# EAGLE design power_board (EAGLE 6.6.0)
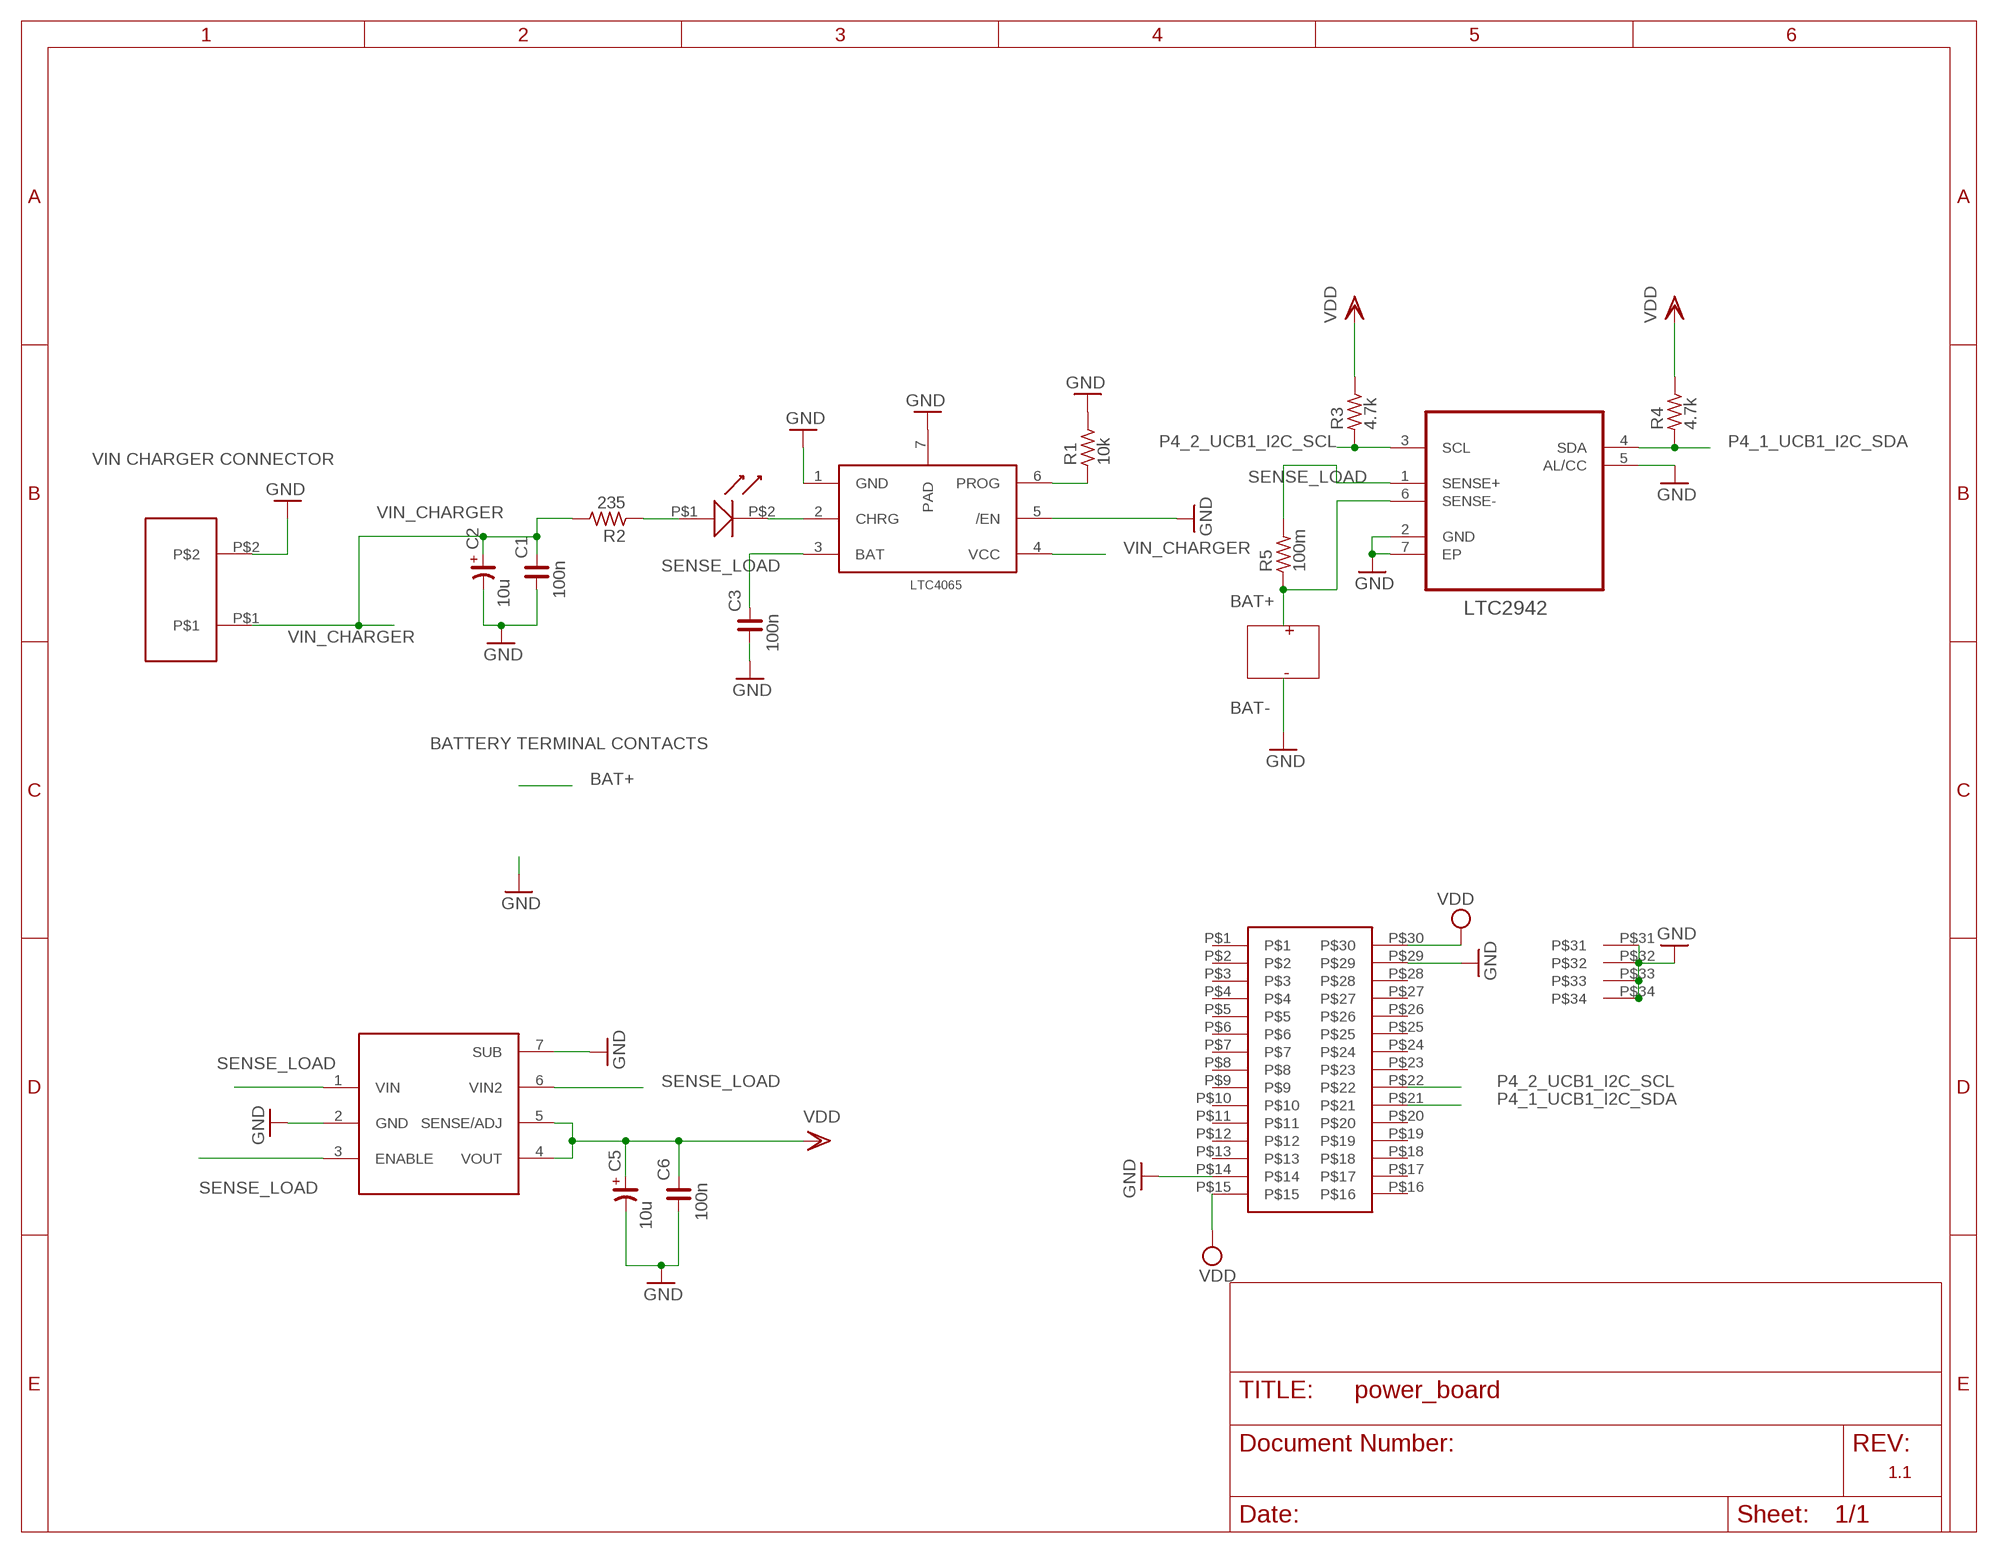
[diagram p0: schematic, sheet 1]

## Parts
C1  100n  C_0402  [C0402]
C2  10u  CP_  [C0402]
C3  100n  C_0402  [C0402]
C5  10u  CP_  [C0402]
C6  100n  C_0402  [C0402]
R1  10k  R_0402  [R0402]
R2  235  R_0402  [R0402]
R3  4.7k  R_0402  [R0402]
R4  4.7k  R_0402  [R0402]
R5  100m  R_0402  [R0402]
U1  LTC2942CDCBTRMPBF  [DFN200X300X80-7N]
U$1  LTC4065  [LTC4065]
U$2  LED0402  [LED_0402]
U$3  55909-0374_PLUG  [55909-0374_PLUG]
U$4  NCP606  [NCP606]
U$5  ASR_2_REC  [ASR_2_CONN]

## Nets
BAT+: R5.1 U1.6(SENSE-)
GND: C1.1 C2.2(-) C3.1 C5.2(-) C6.1 R1.2 U1.2(GND) U1.5(AL/CC) U1.7(EP) U$1.1(GND) U$1.5(/EN) U$1.7(PAD) U$3.P$14 U$3.P$29 U$3.P$31 U$3.P$32 U$3.P$33 U$3.P$34 U$4.2(GND) U$4.7(SUB) U$5.P$2
N$1: R1.1 U$1.6(PROG)
N$2: R2.1 U$2.P$1(A)
N$3: U$1.2(CHRG) U$2.P$2(K)
P4_1_UCB1_I2C_SDA: R4.1 U1.4(SDA) U$3.P$21
P4_2_UCB1_I2C_SCL: R3.1 U1.3(SCL) U$3.P$22
SENSE_LOAD: C3.2 R5.2 U1.1(SENSE+) U$1.3(BAT) U$4.1(VIN) U$4.3(ENABLE) U$4.6(VIN2)
VDD: C5.1(+) C6.2 R3.2 R4.2 U$3.P$15 U$3.P$30 U$4.4(VOUT) U$4.5(SENSE/ADJ)
VIN_CHARGER: C1.2 C2.1(+) R2.2 U$1.4(VCC) U$5.P$1
Unconnected: U$3.P$1 U$3.P$2 U$3.P$3 U$3.P$4 U$3.P$5 U$3.P$6 U$3.P$7 U$3.P$8 U$3.P$9 U$3.P$10 U$3.P$11 U$3.P$12 U$3.P$13 U$3.P$16 U$3.P$17 U$3.P$18 U$3.P$19 U$3.P$20 U$3.P$23 U$3.P$24 U$3.P$25 U$3.P$26 U$3.P$27 U$3.P$28

## Notes on the sheet
- VIN CHARGER CONNECTOR
- +
- -
- BAT-
- BATTERY TERMINAL CONTACTS
- 1.1

## Library data of the parts
C1 C3 C6 = rc-master-smd:C_: NON-POLARIZED CAP
C2 C5 = rc-master-smd:CP_: POLARIZED CAP
R1-R5 = rc-master-smd:R_: RESISTOR
U1 = ltc2942:LTC2942CDCBTRMPBF: Battery Gas Gauge with Temperature, Voltage Measurement; MPN: LTC2942CDCB#TRMPBF; OC_FARNELL: -; OC_NEWARK: 67R9018; PACKAGE: DFN-6; SUPPLIER: Linear Technology
U$1 = ltc4065:LTC4065
U$2 = LED_0402:LED0402
U$3 = Molex_SlimStack:55909-0374_PLUG: 55909-0374_PLUG MOLEX; VENDOR: DK
U$4 = NCP606:NCP606
U$5 = ASR_2_CONN:ASR_2_REC

## Board
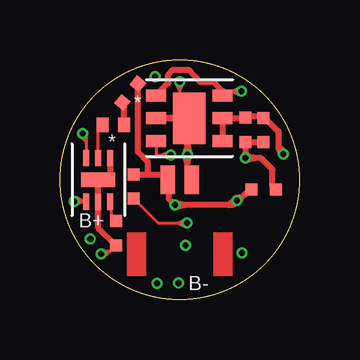
[diagram p1: board, top side]
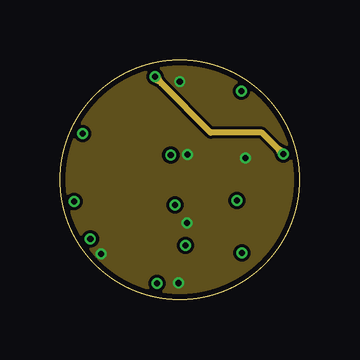
[diagram p2: board, inner layer Route2]
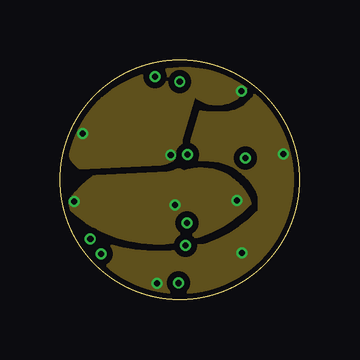
[diagram p3: board, inner layer Route15]
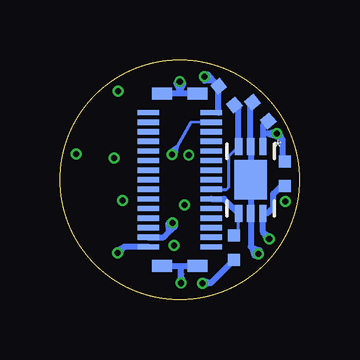
[diagram p4: board, bottom side, seen from below]

Size 10 x 10 mm. Coordinates in mm from the lower left corner, seen from the top.
Outline: circle at 5,5 radius 5
Copper layers (1+2*15+16): Top 0.0356mm / dielectric 0.1702mm / Route2 0.0178mm / dielectric 47mil / Route15 0.0178mm / dielectric 0.1702mm / Bottom 0.0356mm
Design rules "LaenPCBOrder - 4 layers *": minimum track width 5mil, minimum drill 10mil, track to track 5mil, track to pad 5mil, pad to pad 5mil, via to via 5mil, smd to smd 5mil, copper to edge 10mil, drill to drill 5mil, minimum pad ring 4mil, minimum via ring 4mil, stop-mask expansion 3mil, vias tented up to drill 20mil, thermal gap 10mil

### Footprints (pad centres in the part's own frame; a part is rotated, then mirrored left to right if it is on the bottom)
C0402 = smd 0.5 x 0.5: 1 -0.508,0; 2 0.508,0
R0402 = smd 0.5 x 0.5: 1 -0.508,0; 2 0.508,0
DFN200X300X80-7N = smd 0.711 x 0.305: 1 -1.397,0.508; 2 -1.397,0; 3 -1.397,-0.508; 4 1.397,-0.508; 5 1.397,0; 6 1.397,0.508 | smd 1.65 x 1.35: 7 0,0
LTC4065 = smd 0.675 x 0.25: 1 -0.912,0.5; 2 -0.912,0; 3 -0.912,-0.5; 4 0.912,-0.5; 5 0.912,0; 6 0.912,0.5 | smd 0.61 x 1.42: 7 0,0
LED_0402 = smd 0.5 x 0.6: P$1 -0.45,0; P$2 0.45,0
55909-0374_PLUG = smd 0.9 x 0.22: P$1 -1.315,2.8; P$2 -1.315,2.4; P$3 -1.315,2; P$4 -1.315,1.6; P$5 -1.315,1.2; P$6 -1.315,0.8; P$7 -1.315,0.4; P$8 -1.315,0; P$9 -1.315,-0.4; P$10 -1.315,-0.8; P$11 -1.315,-1.2; P$12 -1.315,-1.6; P$13 -1.315,-2; P$14 -1.315,-2.4; P$15 -1.315,-2.8; P$16 1.315,-2.8; P$17 1.315,-2.4; P$18 1.315,-2; P$19 1.315,-1.6; P$20 1.315,-1.2; P$21 1.315,-0.8; P$22 1.315,-0.4; P$23 1.315,0; P$24 1.315,0.4; P$25 1.315,0.8; P$26 1.315,1.2; P$27 1.315,1.6; P$28 1.315,2; P$29 1.315,2.4; P$30 1.315,2.8 | smd 0.85 x 0.5: P$31 -0.74,-3.6; P$32 0.74,-3.6; P$33 -0.74,3.6; P$34 0.74,3.6
NCP606 = smd 0.83 x 0.5: 1 -1.385,0.95; 2 -1.385,0; 3 -1.385,-0.95; 4 1.385,-0.95; 5 1.385,0; 6 1.385,0.95 | smd 1.35 x 2.15: 7 0,0
ASR_2_CONN = smd 0.6 x 1.2: P$1 -0.5,0; P$2 0.5,0

### Placement (x,y rotation side)
C1  3.08,4.72 90 top
C2  8.49,4.58 0 top
C3  1.63,7.84 310 bottom
C5  7.74,7.08 270 top
C6  8.5,7.07 90 top
R1  2.34,2.77 270 top
R2  2.93,8.62 50 top
R3  3.05,8.51 130 bottom
R4  2.73,2.17 270 bottom
R5  0.62,5.25 90 bottom
U1  2.04,4.99 270 bottom
U$1  1.6,5 270 top
U$2  2.22,7.3 180 top
U$3  5,5 0 bottom
U$4  5.4,7.57 0 top
U$5  5,5 0 top

### Tracks (layer width: path | path; a pad name or v marks a point on that pad's centre or on a via)
BAT+  (via drill 0.25)
  Bottom 0.127: R5.1 0.68,4.59
  Bottom 0.22: U1.6 1.36,3.6
  Bottom 0.25: v1.27,2.53 1.48,2.77 1.53,2.81 | 1.53,2.81 U1.6 | 1.53,2.81 1.22,2.62 v1.27,2.53 | 1.53,2.81 1.36,2.49 v1.27,2.53 | R5.1 0.76,4.74 1.08,4.43 1.1,4.36 1.1,3.82 1.36,3.6
GND  (via drill 0.25)
  Top 0.127: C6.1 | 5.5,7.28 5.79,7.57 U$4.7 | U$4.7 5.02,7.57 | 5,7.97 U$4.7 | 5.36,7.57 5.38,7.6 5,7.98 5,8.72 | 5,8.72 v5,9.1 | v7.74,5.9 7.74,6.28 | C5.2 | R1.2 2.09,2.02 | 2.09,2.02 1.97,1.9 v1.73,1.9 | C1.1 4.09,3.2 4.92,3.2 | 4.92,3.2 v5.3,3.2 | U$1.1 2.1,5.83 | U$1.7 U1.7 2.1,4.98 | 5,8.72 5.15,9.03 v5,9.1 | 5,8.72 4.85,9.03 v5,9.1 | 7.74,6.28 7.6,5.97 v7.74,5.9 | 7.74,6.28 7.89,5.97 v7.74,5.9 | 2.09,2.02 1.75,2.06 v1.73,1.9 | 2.09,2.02 1.84,1.78 v1.73,1.9 | 4.92,3.2 5.23,3.05 v5.3,3.2 | 4.92,3.2 5.23,3.35 v5.3,3.2
  Top 0.25: U$1.7 U$1.5 1.6,3 R1.2 | 7.74,6.28 C5.2 | 2.1,5.83 2.1,4.98 | C5.2 C6.1 | C2.2 8.87,4.72 8.87,5.42 8.39,5.9 8.12,5.9 | 8.12,5.9 v7.74,5.9 | 5.5,7.57 U$4.7 | 5,7.98 5,7.97 | 5.02,7.57 U$4.2 5.32,7.57 5.32,6.43 | 5.32,6.43 v5.32,6.05 | U$5.P$2 5.32,5 5.32,5.67 | 5.32,5.67 v5.32,6.05 | 8.12,5.9 7.77,6 v7.74,5.9 | 8.12,5.9 7.77,5.8 v7.74,5.9 | 5.32,6.43 5.21,6.08 v5.32,6.05 | 5.32,6.43 5.41,6.08 v5.32,6.05 | 5.32,5.67 5.41,6.02 v5.32,6.05 | 5.32,5.67 5.21,6.02 v5.32,6.05
  Bottom 0.127: U$3.P$29 4.55,7.38 | U$3.P$33 5.79,8.65 | 5,8.72 5,8.62 5.02,8.6 | U$3.P$32 4.22,1.36 | U$3.P$14 | 5.44,2.85 5.3,2.99 | 2.04,2.21 1.99,2.17 | 2.06,6.23 U1.2 | U$1.7 U1.7 2.04,4.56 U$1.7 | U$1.7 | 4.55,7.38 | 4.55,7.38 5.12,6.38 | 5.12,6.38 v5.32,6.05 | 5.15,9.03 v5,9.1 4.85,9.03 | 1.67,2.05 v1.73,1.9 1.88,1.84 | 5.46,3.19 v5.3,3.2 5.19,3.08 | 5.12,6.38 5.15,6.04 v5.32,6.05 | 5.12,6.38 5.41,6.19 v5.32,6.05 | 4.95,1.07 4.8,0.76 v4.95,0.69 5.09,0.76 4.95,1.07
  Bottom 0.25: U$3.P$34 5.02,8.6 U$3.P$33 | v5,9.1 5,8.72 | U$3.P$14 5.68,2.6 5.44,2.85 | 5.3,2.99 v5.3,3.2 | U$3.P$31 4.95,1.4 | 4.95,1.4 U$3.P$32 | v4.95,0.69 4.95,1.07 4.95,1.4 | 2.04,2.21 U1.5 2.04,4.56 | 1.99,2.17 v1.73,1.9 | U1.2 U1.7 | 5,8.72 5.15,9.03 | 5,8.72 4.85,9.03 | 1.99,2.17 1.67,2.05 | 1.99,2.17 1.88,1.84 | 5.44,2.85 5.46,3.19 | 5.44,2.85 5.19,3.08 | 2.06,6.23 2.05,6.25 2.05,8.15 C3.1
  pour Route2 (isolate 0.1): 0,5 arc90 5,0 arc90 10,5 arc90 5,10 arc90
N$1
  Top 0.127: U$1.6 2.15,3.31 R1.1
N$2
  Top 0.127: U$2.P$1 2.86,7.48 2.69,7.48 | 2.69,8.02 2.61,8.16 R2.1
  Top 0.25: 2.69,7.48 2.69,8.02
N$3
  Top 0.127: 1.65,7.17 U$2.P$2 arc90 1.6,7.12 U$1.2
N$4  (via drill 0.25)
  other vias: 5.25,2.26
P4_1_UCB1_I2C_SDA
  Bottom 0.127: R4.1 arc-90 2.54,2.88 U1.4
  Bottom 0.25: U$3.P$21 3.15,4.2 U1.4
P4_2_UCB1_I2C_SCL
  Bottom 0.127: U$3.P$22 3.05,4.6 2.96,4.7 2.96,5.98 U1.3
  Bottom 0.15: 2.54,8 R3.1
  Bottom 0.25: U1.3 2.54,8
SENSE_LOAD  (via drill 0.25)
  Top 0.127: U$4.1 | v0.94,6.93 0.94,6.9 1.1,6.75 1.1,6.58 | U$4.3 4.01,6.03 4.24,6.03 | 4.24,6.03 v4.62,6.03 | U$4.6 6.79,8.7 v7.57,8.7 | 1.1,6.58 U$1.3 | 1.1,6.58 1.11,6.92 v0.94,6.93 | 1.1,6.58 0.84,6.8 v0.94,6.93 | 4.24,6.03 4.55,5.88 v4.62,6.03 | 4.24,6.03 4.55,6.18 v4.62,6.03 | v7.57,8.7 7.5,8.56 7.19,8.7 7.5,8.85 v7.57,8.7
  Top 0.25: 6.79,8.7 6.4,9.09 5.84,9.09 5.38,9.59 4.7,9.59 4.51,9.38 4.51,9.03 U$4.1
  Bottom 0.127: 1.51,6.41 U1.1 | 0.71,6.67 v0.94,6.93 | 1.47,6.93 1.33,6.93 | v0.94,6.93 1.01,6.84 | v0.94,6.93 0.95,7.04 | v0.94,6.93 0.97,6.83
  Bottom 0.25: 1.51,6.41 1.51,6.89 1.47,6.93 | C3.2 1.53,7.28 U1.1 | 1.33,6.93 v0.94,6.93 0.84,6.94 0.71,6.67 | 0.71,6.67 1.01,6.84 | 1.33,6.93 0.95,7.04 | 1.33,6.93 0.97,6.83 | 0.71,6.67 0.71,5.76 R5.2
  pour Route15 (isolate 0.25): 0.49,6.84 arc90 0.83,5.5 4.23,5.66 arc90 5.07,6.7 5.62,8.51 arc103 7.84,8.95 arc90 0.48,6.86
VDD  (via drill 0.25)
  Top 0.127: C6.2 | C5.1 7.74,7.57
  Top 0.25: U$4.4 U$4.5 7.72,7.57 C5.1 7.78,7.63 8.5,7.63 8.55,7.58 | C6.2 8.55,7.58 | 8.55,7.58 9.12,7.02 9.12,6.39 | 9.12,6.39 9.12,6.28 v9.33,6.07 | 9.12,6.39 9.23,6.04 v9.33,6.07 | 9.12,6.39 9.39,6.15 v9.33,6.07
  Route2 0.25: v9.33,6.07 9.06,6.34 | 9.06,6.34 8.43,6.97 6.29,6.97 4.23,9.03 | 4.23,9.03 v3.96,9.29 | 9.06,6.34 9.24,6.02 v9.33,6.07 | 9.06,6.34 9.38,6.16 v9.33,6.07 | 4.23,9.03 4.05,9.34 v3.96,9.29 | 4.23,9.03 3.91,9.2 v3.96,9.29
  Bottom 0.127: 3.38,7.8 U$3.P$30 | 7.33,2.19 7.31,2.2 7.44,1.88 v7.59,1.95 7.64,2.04 | 3.67,0.72 3.72,0.68 | 3.62,9.14 3.77,9.29 | 3.67,0.72 3.96,0.54 v4.05,0.68 4,0.83 3.67,0.72 | 3.96,9.13 v3.96,9.29 3.84,9.4
  Bottom 0.25: 3.38,7.8 R3.2 3.62,9.14 | U$3.P$15 7.31,2.2 7.64,2.04 | 7.33,2.19 v7.59,1.95 | R4.2 3.67,0.72 | 3.72,0.68 v4.05,0.68 | 3.77,9.29 v3.96,9.29 | 3.62,9.14 3.96,9.13 | 3.62,9.14 3.84,9.4
  pour Route15 (isolate 0.25, rank 3): 0.97,4.95 arc90 4.25,0.15 arc90 10,5.01 arc90 5,10.01 0.63,7.17 1.53,6.51 2.34,6.58 0.94,5.18 0.91,5.12 0.79,5
VIN_CHARGER  (via drill 0.25)
  Top 0.127: 3.38,9 R2.2 | 4.53,4.87 arc90 U$5.P$1 4.5,5.23 | 1.15,3.98 U$1.4 | U$1.4 1.05,3.98 | 4.53,4.22 4.54,4.21 | 4.54,4.21 v4.81,3.94 | v0.6,4.1 0.98,4.1 | 0.98,4.1 1.09,4.1 arc-90 U$1.4 | v7.38,4.13 7.69,4.36 | 4.54,4.21 4.65,3.89 v4.81,3.94 | 4.54,4.21 4.86,4.1 v4.81,3.94 | 7.69,4.36 7.35,4.3 v7.38,4.13 | 7.69,4.36 7.53,4.06 v7.38,4.13 | 0.98,4.1 0.67,4.25 v0.6,4.1 | 0.98,4.1 0.67,3.95 v0.6,4.1
  Top 0.25: C1.2 3.67,5.23 | 3.67,5.23 4.5,5.23 | 4.53,4.87 4.53,4.22 | R2.2 3.26,6.17 3.67,5.76 3.67,5.23 | 7.69,4.36 C2.1 | v7.38,4.13 7.19,3.94 7.05,3.94 | 7.05,3.94 5.19,3.94 | 5.19,3.94 v4.81,3.94 | 5.19,3.94 4.84,4.04 v4.81,3.94 | 5.19,3.94 4.84,3.84 v4.81,3.94 | 7.05,3.94 7.4,4.03 v7.38,4.13 | 7.05,3.94 7.3,4.21 v7.38,4.13
  pour Route15 (isolate 0.25, rank 2): 0.29,3.9 arc90 7.95,4.01 arc90 5.18,5.33 arc90

### Text on the board
tNames: * | * | B+ | B-
bNames: *
bDocu: * | *